# EasyEDA Pro project ProDoc_PCB1_2025-02-16.epro

# Board PCB1
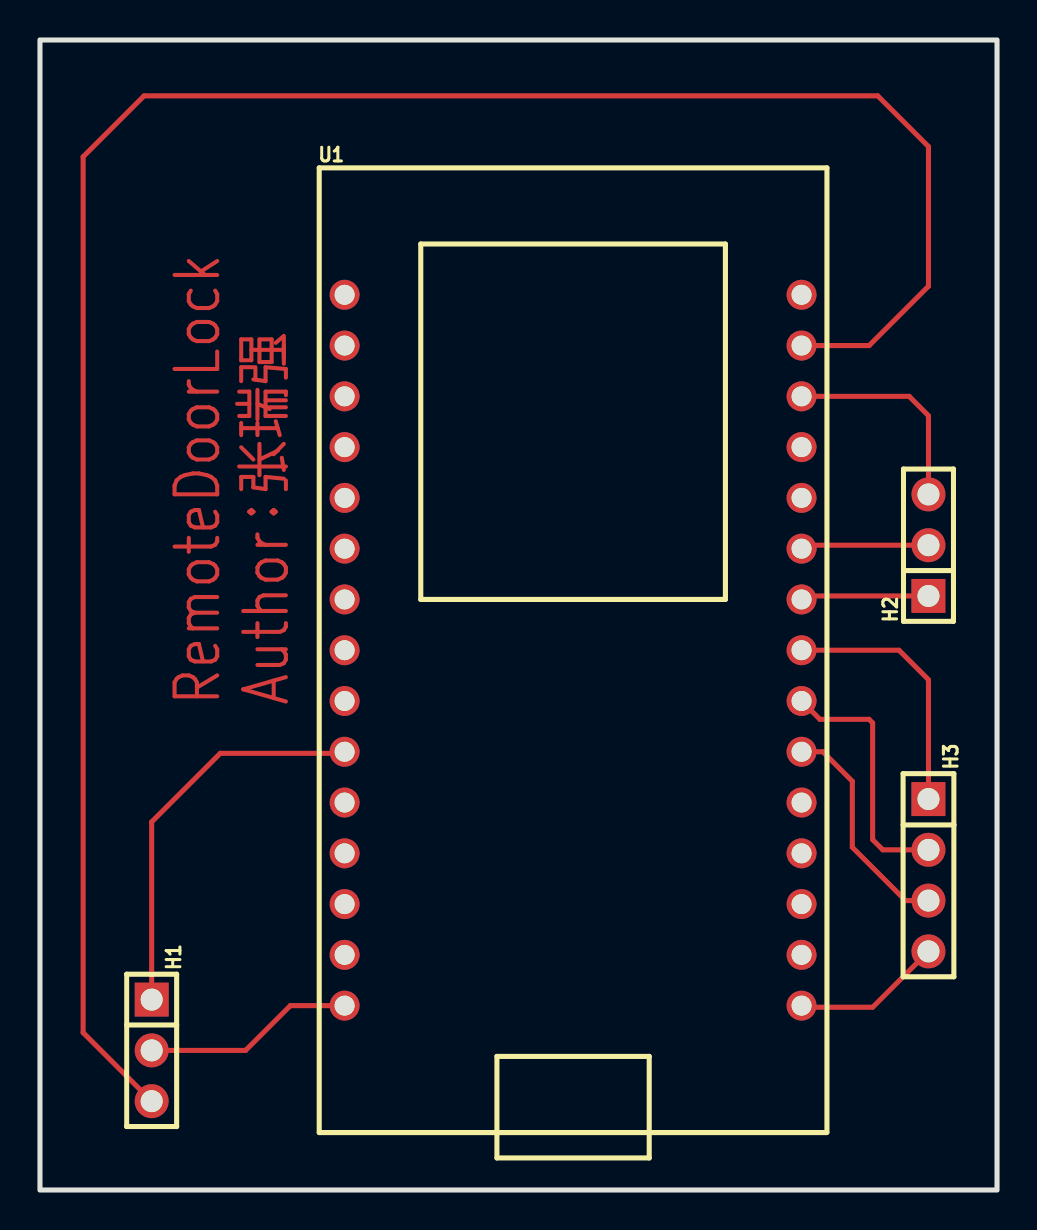
[diagram p0: board, top side]
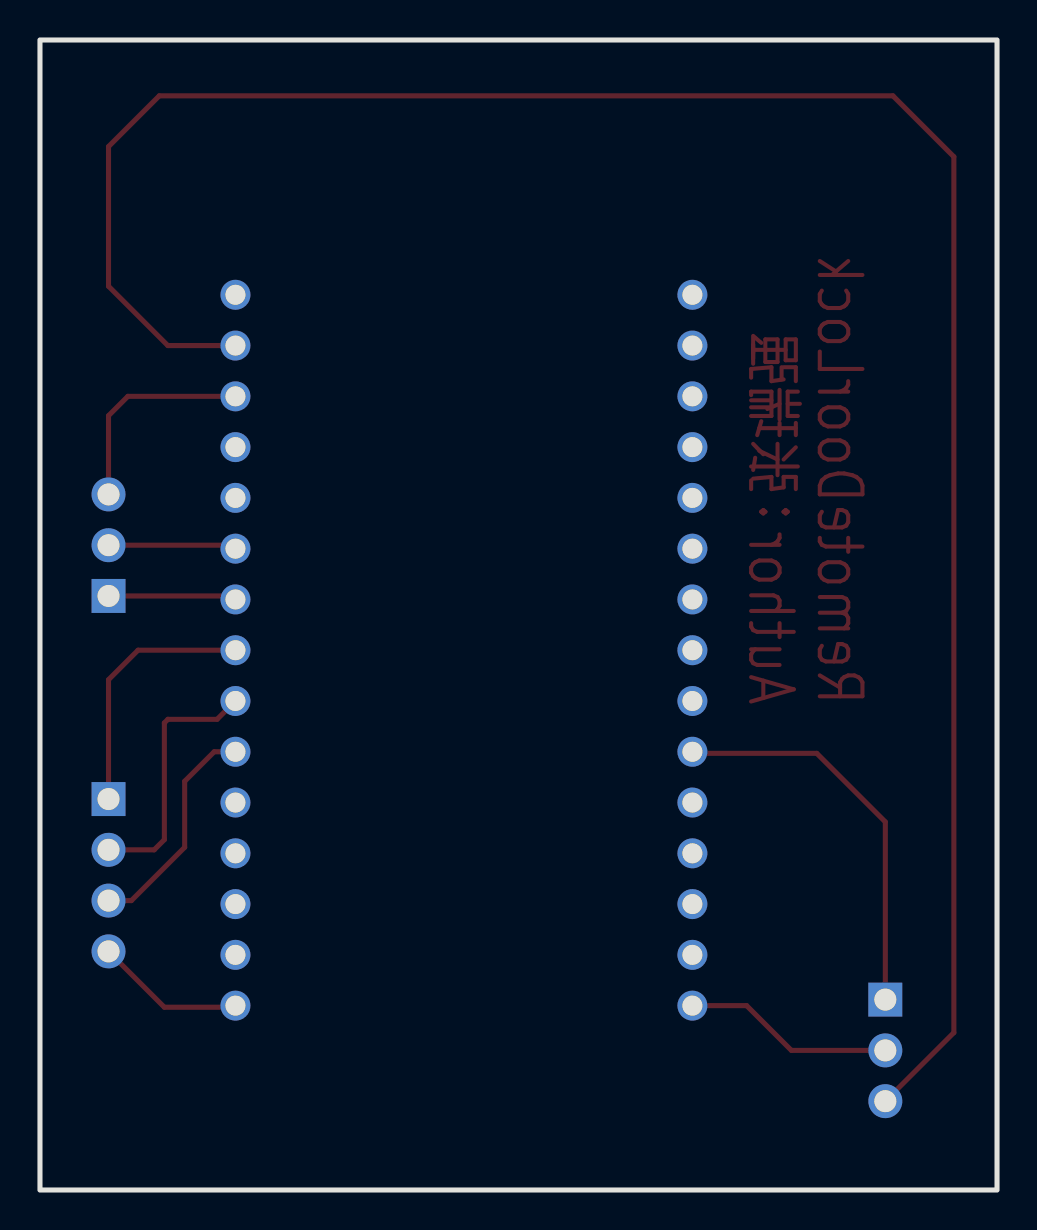
[diagram p1: board, bottom side, seen from below]

Outline 47.88 x 57.53 mm; copper layers: Top Layer, Bottom Layer. Coordinates in mm from the lower left corner of the outline.
Outline path: rectangle 0,57.53 47.88,0
Stack: Top Layer 0.035mm / Dielectric1 1.51mm FR4 er 4.5 / Bottom Layer 0.035mm

## Design rules (mm)
template: JLCPCB Capability(Two Layers Board)
spacing copperThickness1oz (default): track to track 0.102, other pairs 0.152 to 0.3
spacing copperThickness2oz: track to track 0.203, other pairs 0.152 to 0.3
track width copperThickness1oz (default): min 0.127, default 0.254, max 2.54
track width copperThickness2oz: min 0.203, default 0.254, max 2.54
differential pair differentialPair (default): width min 0.127, default 0.254, max 2.54; gap min 0.152, default 0.152
via viaSize (default): diameter min 0.5, default 0.61, max 10; hole min 0.3, default 0.305, max 6.3

## Placement (name value [footprint] x y rotation side)
H1  PZ254V-11-03P  [HDR-TH_3P-P2.54-V-M]  5.59 6.98 270 top
H2  PZ254V-11-03P  [HDR-TH_3P-P2.54-V-M]  44.45 32.26 90 top
H3  PZ254V-11-04P  [HDR-TH_4P-P2.54-V-M]  44.45 15.75 270 top
U1  NODEMCU(12S)  [COMM-TH_L43.7-W25.4-P2.54_NODEMCU]  26.67 27 0 top

## Footprints (pads in the part's own frame, mm; a bottom-side part is the same pattern mirrored in y, then rotated)
COMM-TH_L43.7-W25.4-P2.54_NODEMCU
  round 1.5 hole 1: 1(-11.43,17.78) 2(-11.43,15.24) 3(-11.43,12.7) 4(-11.43,10.16) 5(-11.43,7.62) 6(-11.43,5.08) 7(-11.43,2.54) 8(-11.43,0) 9(-11.43,-2.54) 10(-11.43,-5.08) 11(-11.43,-7.62) 12(-11.43,-10.16) 13(-11.43,-12.7) 14(-11.43,-15.24) 15(-11.43,-17.78) 16(11.43,-17.78) 17(11.43,-15.24) 18(11.43,-12.7) 19(11.43,-10.16) 20(11.43,-7.62) 21(11.43,-5.08) 22(11.43,-2.54) 23(11.43,0) 24(11.43,2.54) 25(11.43,5.08) 26(11.43,7.62) 27(11.43,10.16) 28(11.43,12.7) 29(11.43,15.24) 30(11.43,17.78)
HDR-TH_3P-P2.54-V-M
  rect 1.7x1.7 hole 1.1: 1(-2.54,0)
  round 1.7 hole 1.1: 2(0,0) 3(2.54,0)
HDR-TH_4P-P2.54-V-M
  rect 1.7x1.7 hole 1.1: 1(-3.81,0)
  round 1.7 hole 1.1: 2(-1.27,0) 3(1.27,0) 4(3.81,0)

## Nets
$1N515: H1.2 U1.15
$1N522: H1.1 U1.10
$1N621: H1.3 U1.29
$1N678: H2.3 U1.28
$1N683: H2.2 U1.25
$1N689: H2.1 U1.24
$1N799: H3.4 U1.16
$1N803: H3.1 U1.23
$1N808: H3.2 U1.22
$1N815: H3.3 U1.21

Pads without a net: U1 1 2 3 4 5 6 7 8 9 11 12 13 14 17 18 19 20 26 27 30

## Routing (per net, layer and track width the routed paths; a pad name or vN(x,y) marks a point on that pad's centre or on a via; arc(x,y) is an arc through that point)
$1N515: length 10.6
  Top Layer w0.254: U1.15 12.53,9.22 10.29,6.98 H1.2
$1N522: length 20
  Top Layer w0.254: U1.10 15.16,21.84 9.02,21.84 5.59,18.42 H1.1
$1N621: length 107.8
  Top Layer w0.254: H1.3 2.16,7.87 2.16,51.69 5.21,54.74 41.91,54.74 44.45,52.2 44.45,45.21 41.48,42.24 38.1,42.24
$1N678: length 10.7
  Top Layer w0.254: H2.3 44.45,38.73 43.48,39.7 38.1,39.7
$1N683: length 6.4
  Top Layer w0.254: 38.1,32.08 38.27,32.26 H2.2
$1N689: length 6.4
  Top Layer w0.254: 44.45,29.72 38.27,29.72 38.1,29.54
$1N799: length 7.5
  Top Layer w0.254: 38.1,9.22 38.18,9.14 41.66,9.14 H3.4
$1N803: length 12.9
  Top Layer w0.254: 38.1,27 42.97,27 44.45,25.53 H3.1
$1N808: length 12.9
  Top Layer w0.254: 38.1,24.46 39.02,23.55 41.48,23.55 41.66,23.37 41.66,17.53 42.16,17.02 H3.2
$1N815: length 11.4
  Top Layer w0.254: 38.1,21.92 39.16,21.92 40.64,20.45 40.64,17.14 43.31,14.48 H3.3

## Text on the board
Top Layer: RemoteDoorLock / Author：张瑞强
